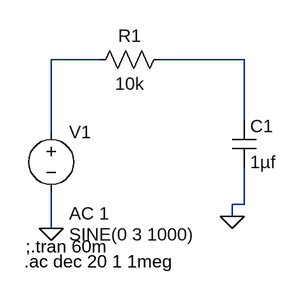
[diagram p0: schematic RC Low Pass filter.asc]
RC Low Pass filter.asc, the LTspice schematic file:
Version 4
SHEET 1 880 680
WIRE -32 64 -96 64
WIRE 160 64 48 64
WIRE 160 144 160 64
WIRE -96 160 -96 64
WIRE 160 256 160 208
WIRE 160 256 144 256
WIRE 144 272 144 256
WIRE -96 288 -96 240
FLAG -96 288 0
FLAG 144 272 0
SYMBOL voltage -96 144 R0
WINDOW 3 24 152 Left 2
WINDOW 123 24 124 Left 2
WINDOW 39 0 0 Left 0
SYMATTR InstName V1
SYMATTR Value SINE(0 3 1000)
SYMATTR Value2 AC 1
SYMBOL res 64 48 R90
WINDOW 0 0 56 VBottom 2
WINDOW 3 32 56 VTop 2
SYMATTR InstName R1
SYMATTR Value 10k
SYMBOL cap 144 144 R0
SYMATTR InstName C1
SYMATTR Value 1µf
TEXT -130 312 Left 2 !;.tran 60m
TEXT -132 332 Left 2 !.ac dec 20 1 1meg

The netlist it stands for:
* RC Low Pass filter.asc
V1 N001 0 SINE(0 3 1000) AC 1
R1 N002 N001 10k
C1 N002 0 1µf
;.tran 60m
.ac dec 20 1 1meg
.backanno
.end